# EAGLE design Schematic (EAGLE 7.4.0)
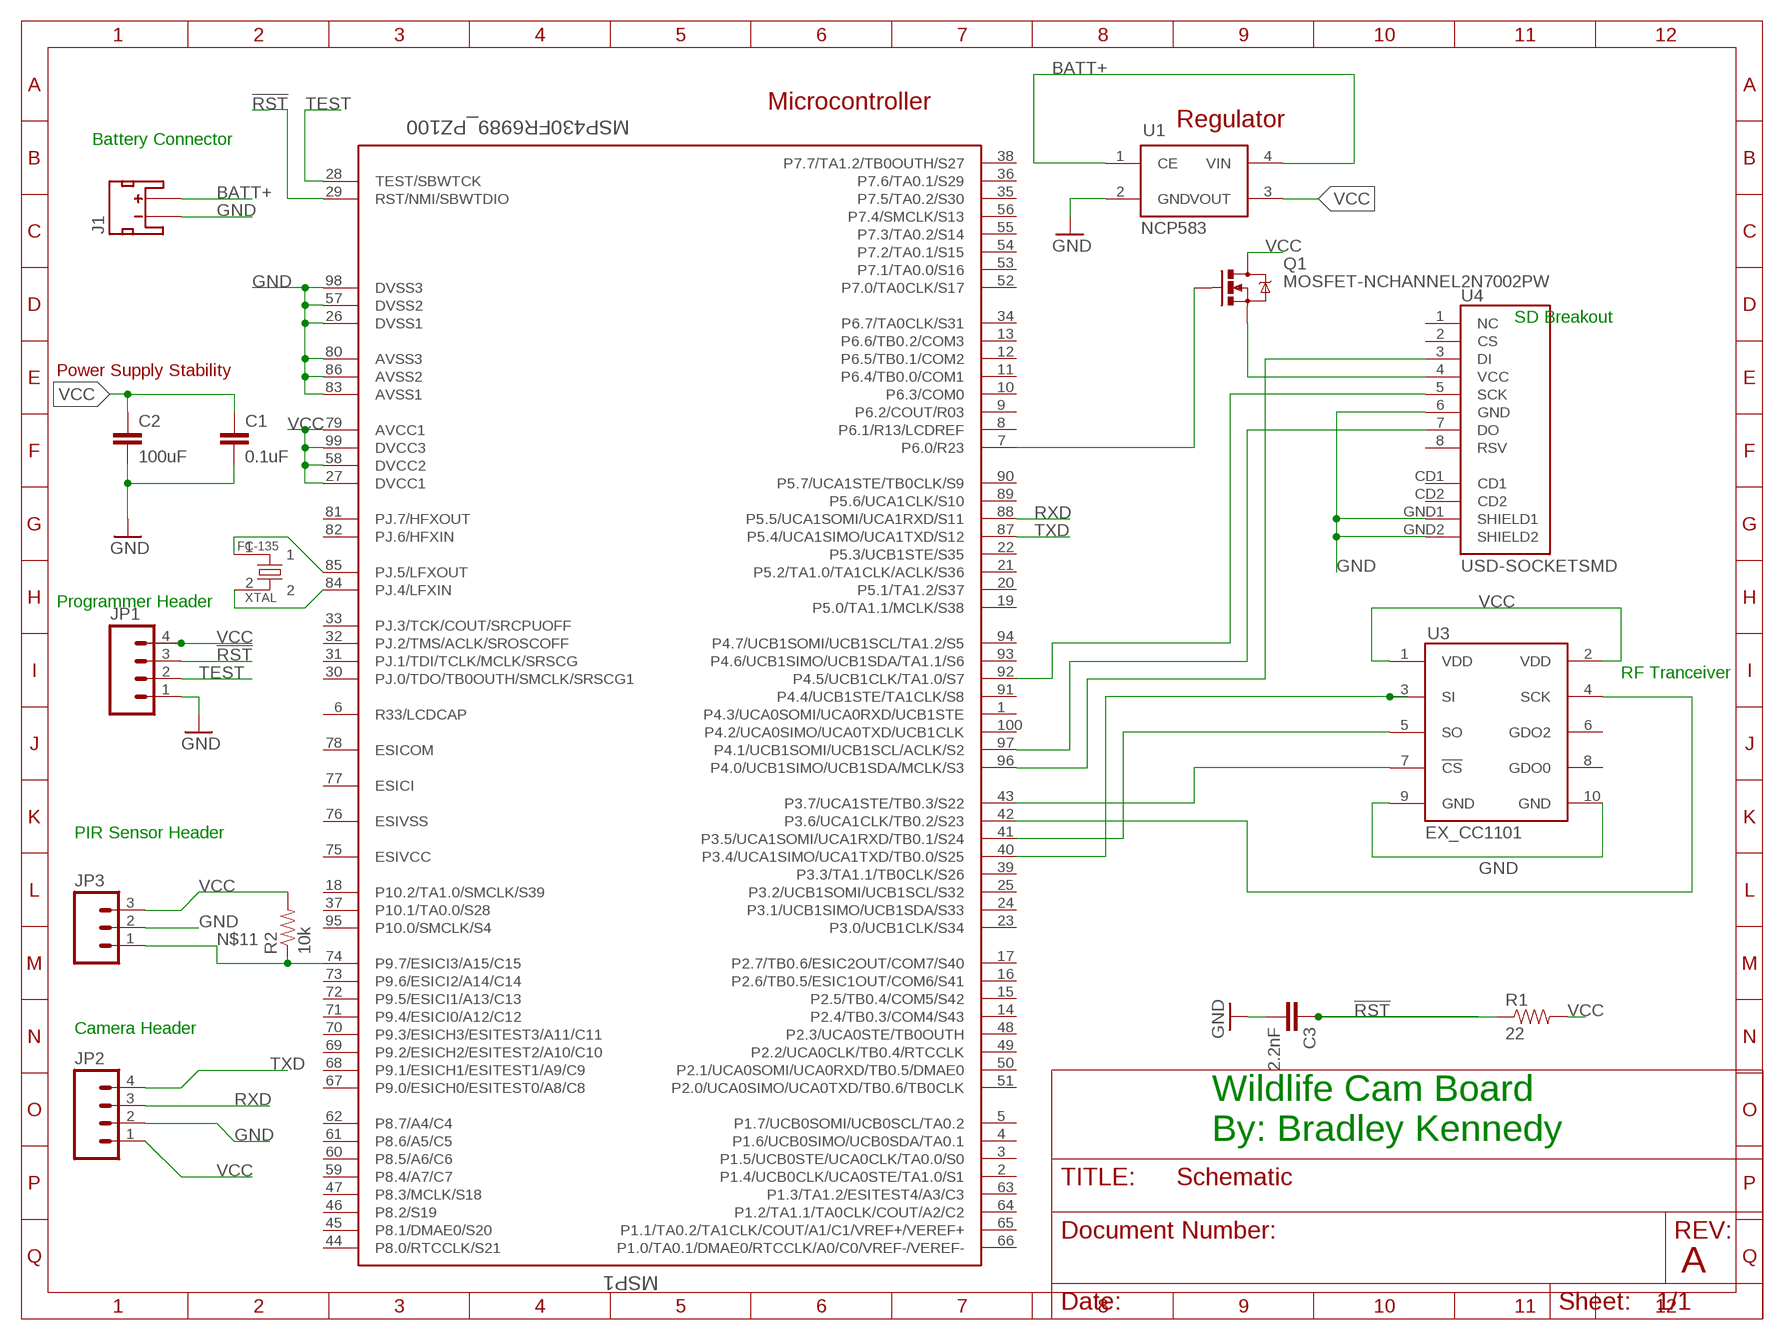
[diagram p0: schematic, sheet 1]

## Parts
C1  0.1uF  1.0UF-25V-+80/-20(0805)  [0805]
C2  100uF  1.0UF-25V-+80/-20(0805)  [0805]
C3  2.2nF  1.0UF-25V-+80/-20(0805)  [0805]
J1  JST_2MM_MALE  [JST-2-SMD]
JP1  M04PTH  [1X04]
JP2  M04PTH  [1X04]
JP3  M03PTH  [1X03]
MSP1  MSP430FR6989_PZ100  [PZ100]
Q1  MOSFET-NCHANNEL2N7002PW  [SOT323]
R1  22  22OHM1/10W1%(0603)  [0603-RES]
R2  10k  10KOHM-1/4W-1%(PTH)HORIZ-KIT  [AXIAL-0.3EZ]
U1  NCP583  [SC82-AB_1PRIMARY]
U3  EX_CC1101  [2X5]
U4  USD-SOCKETSMD  [MICRO-SD-SOCKET-PP]
XTAL  FC-135  [FC-135_1PRIMARY]

## Nets
!RST: C3.1 JP1.3 MSP1.29(RST/NMI/SBWTDIO) R1.1
BATT+: J1.2(+) U1.1(CE) U1.4(VIN)
CLK: MSP1.42(P3.6/UCA1CLK/TB0.2/S23) U3.4(SCK)
GND: C1.2 C2.2 C3.2 J1.1(-) JP1.1 JP2.2 JP3.2 MSP1.26(DVSS1) MSP1.57(DVSS2) MSP1.80(AVSS3) MSP1.83(AVSS1) MSP1.86(AVSS2) MSP1.98(DVSS3) U1.2(GND) U3.9(GND) U3.10(GND) U4.6(GND) U4.GND1(SHIELD1) U4.GND2(SHIELD2)
N$1: MSP1.40(P3.4/UCA1SIMO/UCA1TXD/TB0.0/S25) U3.3(SI)
N$2: MSP1.97(P4.1/UCB1SOMI/UCB1SCL/ACLK/S2) U4.7(DO)
N$3: MSP1.96(P4.0/UCB1SIMO/UCB1SDA/MCLK/S3) U4.3(DI)
N$4: MSP1.84(PJ.4/LFXIN) XTAL.2
N$5: MSP1.85(PJ.5/LFXOUT) XTAL.1
N$6: MSP1.43(P3.7/UCA1STE/TB0.3/S22) U3.7(!CS)
N$7: Q1.2(S) U4.4(VCC)
N$8: MSP1.7(P6.0/R23) Q1.1(G)
N$9: MSP1.92(P4.5/UCB1CLK/TA1.0/S7) U4.5(SCK)
N$11: JP3.1 MSP1.74(P9.7/ESICI3/A15/C15) R2.P$1
N$12: MSP1.41(P3.5/UCA1SOMI/UCA1RXD/TB0.1/S24) U3.5(SO)
RXD: JP2.3 MSP1.88(P5.5/UCA1SOMI/UCA1RXD/S11)
TEST: JP1.2 MSP1.28(TEST/SBWTCK)
TXD: JP2.4 MSP1.87(P5.4/UCA1SIMO/UCA1TXD/S12)
VCC: C1.1 C2.1 JP1.4 JP2.1 JP3.3 MSP1.27(DVCC1) MSP1.58(DVCC2) MSP1.79(AVCC1) MSP1.99(DVCC3) Q1.3(D) R1.2 R2.P$2 U1.3(VOUT) U3.1(VDD) U3.2(VDD)
Unconnected: J1.NC1(PAD1) J1.NC2(PAD2) MSP1.1(P4.3/UCA0SOMI/UCA0RXD/UCB1STE) MSP1.2(P1.4/UCB0CLK/UCA0STE/TA1.0/S1) MSP1.3(P1.5/UCB0STE/UCA0CLK/TA0.0/S0) MSP1.4(P1.6/UCB0SIMO/UCB0SDA/TA0.1) MSP1.5(P1.7/UCB0SOMI/UCB0SCL/TA0.2) MSP1.6(R33/LCDCAP) MSP1.8(P6.1/R13/LCDREF) MSP1.9(P6.2/COUT/R03) MSP1.10(P6.3/COM0) MSP1.11(P6.4/TB0.0/COM1) MSP1.12(P6.5/TB0.1/COM2) MSP1.13(P6.6/TB0.2/COM3) MSP1.14(P2.4/TB0.3/COM4/S43) MSP1.15(P2.5/TB0.4/COM5/S42) MSP1.16(P2.6/TB0.5/ESIC1OUT/COM6/S41) MSP1.17(P2.7/TB0.6/ESIC2OUT/COM7/S40) MSP1.18(P10.2/TA1.0/SMCLK/S39) MSP1.19(P5.0/TA1.1/MCLK/S38) MSP1.20(P5.1/TA1.2/S37) MSP1.21(P5.2/TA1.0/TA1CLK/ACLK/S36) MSP1.22(P5.3/UCB1STE/S35) MSP1.23(P3.0/UCB1CLK/S34) MSP1.24(P3.1/UCB1SIMO/UCB1SDA/S33) MSP1.25(P3.2/UCB1SOMI/UCB1SCL/S32) MSP1.30(PJ.0/TDO/TB0OUTH/SMCLK/SRSCG1) MSP1.31(PJ.1/TDI/TCLK/MCLK/SRSCG) MSP1.32(PJ.2/TMS/ACLK/SROSCOFF) MSP1.33(PJ.3/TCK/COUT/SRCPUOFF) MSP1.34(P6.7/TA0CLK/S31) MSP1.35(P7.5/TA0.2/S30) MSP1.36(P7.6/TA0.1/S29) MSP1.37(P10.1/TA0.0/S28) MSP1.38(P7.7/TA1.2/TB0OUTH/S27) MSP1.39(P3.3/TA1.1/TB0CLK/S26) MSP1.44(P8.0/RTCCLK/S21) MSP1.45(P8.1/DMAE0/S20) MSP1.46(P8.2/S19) MSP1.47(P8.3/MCLK/S18) MSP1.48(P2.3/UCA0STE/TB0OUTH) MSP1.49(P2.2/UCA0CLK/TB0.4/RTCCLK) MSP1.50(P2.1/UCA0SOMI/UCA0RXD/TB0.5/DMAE0) MSP1.51(P2.0/UCA0SIMO/UCA0TXD/TB0.6/TB0CLK) MSP1.52(P7.0/TA0CLK/S17) MSP1.53(P7.1/TA0.0/S16) MSP1.54(P7.2/TA0.1/S15) MSP1.55(P7.3/TA0.2/S14) MSP1.56(P7.4/SMCLK/S13) MSP1.59(P8.4/A7/C7) MSP1.60(P8.5/A6/C6) MSP1.61(P8.6/A5/C5) MSP1.62(P8.7/A4/C4) MSP1.63(P1.3/TA1.2/ESITEST4/A3/C3) MSP1.64(P1.2/TA1.1/TA0CLK/COUT/A2/C2) MSP1.65(P1.1/TA0.2/TA1CLK/COUT/A1/C1/VREF+/VEREF+) MSP1.66(P1.0/TA0.1/DMAE0/RTCCLK/A0/C0/VREF-/VEREF-) MSP1.67(P9.0/ESICH0/ESITEST0/A8/C8) MSP1.68(P9.1/ESICH1/ESITEST1/A9/C9) MSP1.69(P9.2/ESICH2/ESITEST2/A10/C10) MSP1.70(P9.3/ESICH3/ESITEST3/A11/C11) MSP1.71(P9.4/ESICI0/A12/C12) MSP1.72(P9.5/ESICI1/A13/C13) MSP1.73(P9.6/ESICI2/A14/C14) MSP1.75(ESIVCC) MSP1.76(ESIVSS) MSP1.77(ESICI) MSP1.78(ESICOM) MSP1.81(PJ.7/HFXOUT) MSP1.82(PJ.6/HFXIN) MSP1.89(P5.6/UCA1CLK/S10) MSP1.90(P5.7/UCA1STE/TB0CLK/S9) MSP1.91(P4.4/UCB1STE/TA1CLK/S8) MSP1.93(P4.6/UCB1SIMO/UCB1SDA/TA1.1/S6) MSP1.94(P4.7/UCB1SOMI/UCB1SCL/TA1.2/S5) MSP1.95(P10.0/SMCLK/S4) MSP1.100(P4.2/UCA0SIMO/UCA0TXD/UCB1CLK) U3.6(GDO2) U3.8(GDO0) U4.1(NC) U4.2(CS) U4.8(RSV) U4.CD1 U4.CD2

## Notes on the sheet
- Microcontroller
- Regulator
- Battery Connector
- SD Breakout
- Power Supply Stability
- Programmer Header
- RF Tranceiver
- PIR Sensor Header
- Camera Header
- Wildlife Cam Board
  By: Bradley Kennedy
- A

## Library data of the parts
C1-C3 = SparkFun-Capacitors:1.0UF-25V-+80/-20(0805); PROD_ID: CAP-11625; VALUE: 1.0uF
J1 = SparkFun-Connectors:JST_2MM_MALE: Mates to single-cell LiPo batteries. CONN-11443 Now with smashable polarity marks!; BTM_NEG: -; BTM_POS: +; PROD_ID: CONN-11443; TOP_NEG: -; TOP_POS: +
JP1 JP2 = SparkFun-Connectors:M04: Header 4 Standard 4-pin 0.1" header. Use with straight break away headers (SKU : PRT-00116), right angle break away headers (PRT-00553), swiss pins (PRT-00743), machine pins (PRT-00117), and female headers (PRT-00115). Molex polarized connector foot print use with SKU : PRT-08231 with associated crimp pins and housings. 1MM SMD Version SKU: PRT-10208
JP3 = SparkFun-Connectors:M03: Header 3 Standard 3-pin 0.1" header. Use with straight break away headers (SKU : PRT-00116), right angle break away headers (PRT-00553), swiss pins (PRT-00743), machine pins (PRT-00117), and female headers (PRT-00115). Molex polarized connector foot print use with SKU : PRT-08232 with associated crimp pins and housings.
MSP1 = msp430:MSP430FR6989_PZ100
Q1 = SparkFun-DiscreteSemi:MOSFET-NCHANNEL: Common NMOSFET Parts MFG P/N Store ID Prod ID FDD8780 TRANS-09984 SI7820DN TRANS-11055 FDS6630A IC-08089 2N7002PW TRANS-11151 FQP30N06L COM-10213 TRANS-10060 BSS123LT1G TRANS-08345 BSS138 TRANS-00830 BS170 2N7000; PROD_ID: TRANS-11151
R1 = SparkFun-Resistors:22OHM1/10W1%(0603): RES-08698; PROD_ID: RES-08698
R2 = SparkFun-Resistors:10KOHM-1/4W-1%(PTH): RES-12183; PROD_ID: RES-12183
U1 = ncp583:NCP583: NCP583 - Ultra-Low Iq 150 mA CMOS LDO Regulator with Enable The NCP583 series of low dropout regulators are designed for portable battery powered applications which require precise output voltage accuracy and low quiescent current. These devices feature an enable function which lowers current consumption significantly and are offered in two small packages; SC−82AB and the SOT−563. A 1.0 mF ceramic capacitor is the recommended value to be used with these devices on the output pin.
U3 = rf_connect:EX_CC1101: CC1101 Breakout Pins Use this to connect the common CC1101 radio boards
U4 = microSD-Breakout-v14:USD-SOCKET: microSD Socket Push-push type uSD socket. Schematic element and footprint production proven. Spark Fun Electronics SKU : PRT-00127. tDoc lines correctly indicate media card edge positions when inserting (unlocked, locked, depressed).
XTAL = fc-135:FC-135

## Board
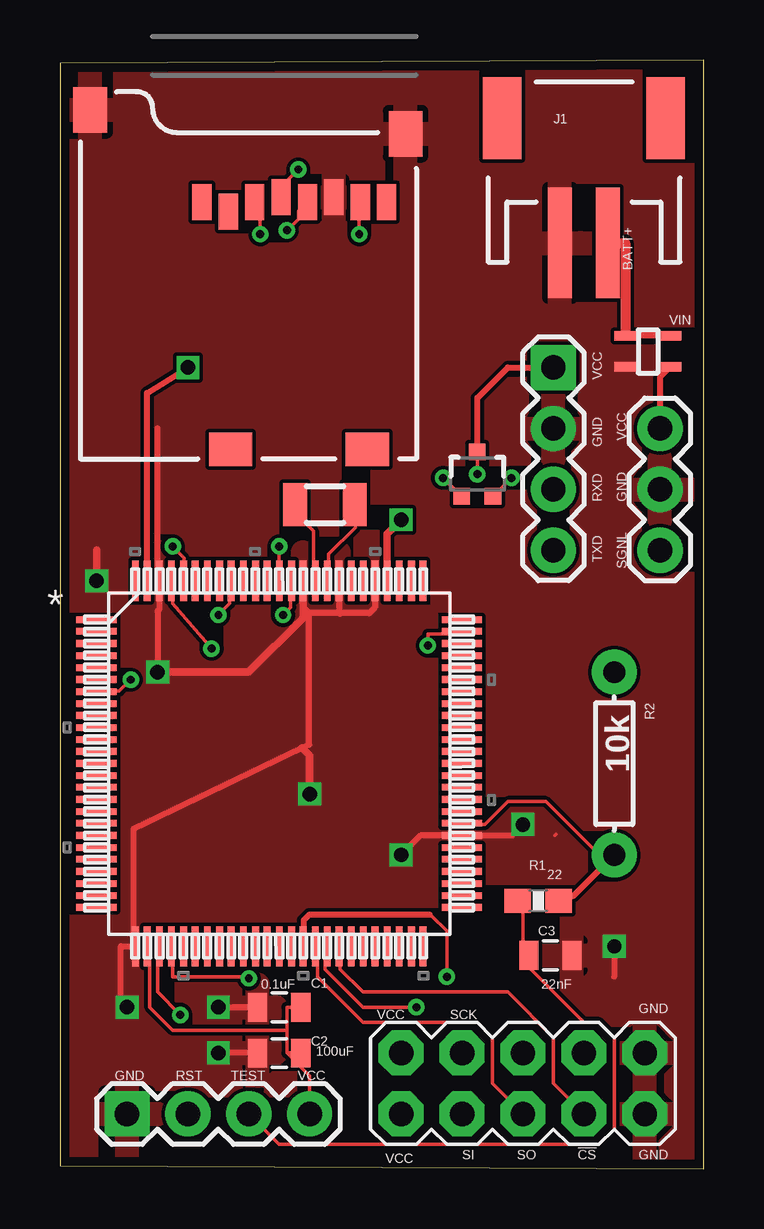
[diagram p1: board, top side]
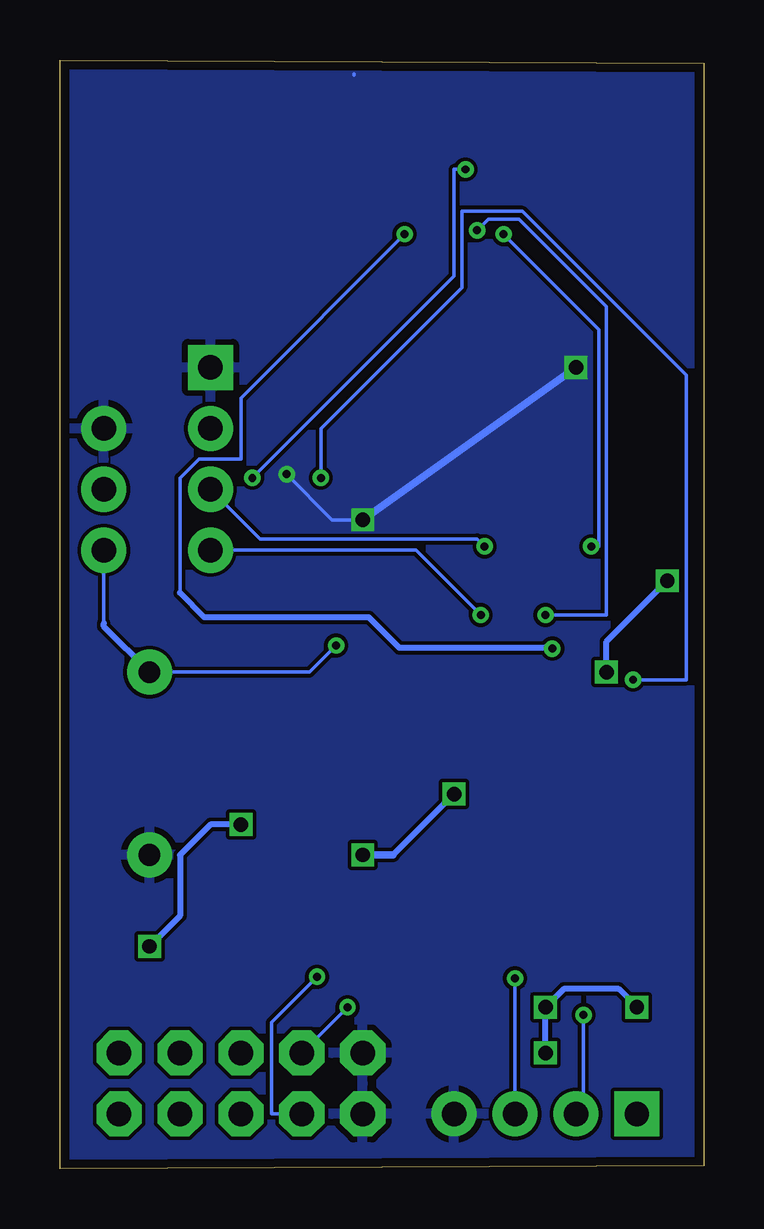
[diagram p2: board, bottom side, seen from below]

Size 26.85 x 46.22 mm. Coordinates in mm from the lower left corner, seen from the top.
Outline: 0,0.13 26.85,0 26.85,46.22 0,46.09 0,0.13
Copper layers (1*16): Top 0.0356mm / dielectric 1.5011mm / Bottom 0.0356mm
Design rules "LaenPCBOrder": minimum track width 6mil, minimum drill 13mil, track to track 6mil, track to pad 6mil, pad to pad 6mil, via to via 6mil, smd to smd 6mil, copper to edge 15mil, drill to drill 6mil, minimum pad ring 7mil, minimum via ring 7mil, stop-mask expansion 3mil, vias tented up to drill 0mil, thermal gap 10mil

### Footprints (pad centres in the part's own frame; a part is rotated, then mirrored left to right if it is on the bottom)
0805 = smd 0.8 x 1.2: 1 -0.9,0; 2 0.9,0
JST-2-SMD = smd 1 x 4.6: 1 -1,-3.7; 2 1,-3.7 | smd 1.6 x 3.4: NC1 -3.4,1.5; NC2 3.4,1.5
1X04 = drill 1.016 pad 1.88 square: 1 0,0 | drill 1.016 pad 1.88: 2 2.54,0; 3 5.08,0; 4 7.62,0
1X03 = drill 1.016 pad 1.88: 1 0,0; 2 2.54,0; 3 5.08,0
PZ100 = smd 1.676 x 0.279: 1 -7.62,5.994; 2 -7.62,5.512; 3 -7.62,5.004; 4 -7.62,4.496; 5 -7.62,3.988; 6 -7.62,3.505; 7 -7.62,2.997; 8 -7.62,2.489; 9 -7.62,2.007; 10 -7.62,1.499; 11 -7.62,0.991; 12 -7.62,0.508; 13 -7.62,0; 14 -7.62,-0.508; 15 -7.62,-0.991; 16 -7.62,-1.499; 17 -7.62,-2.007; 18 -7.62,-2.489; 19 -7.62,-2.997; 20 -7.62,-3.505; 21 -7.62,-3.988; 22 -7.62,-4.496; 23 -7.62,-5.004; 24 -7.62,-5.512; 25 -7.62,-5.994; 51 7.62,-5.994; 52 7.62,-5.512; 53 7.62,-5.004; 54 7.62,-4.496; 55 7.62,-3.988; 56 7.62,-3.505; 57 7.62,-2.997; 58 7.62,-2.489; 59 7.62,-2.007; 60 7.62,-1.499; 61 7.62,-0.991; 62 7.62,-0.508; 63 7.62,0; 64 7.62,0.508; 65 7.62,0.991; 66 7.62,1.499; 67 7.62,2.007; 68 7.62,2.489; 69 7.62,2.997; 70 7.62,3.505; 71 7.62,3.988; 72 7.62,4.496; 73 7.62,5.004; 74 7.62,5.512; 75 7.62,5.994 | smd 0.279 x 1.676: 26 -5.994,-7.62; 27 -5.512,-7.62; 28 -5.004,-7.62; 29 -4.496,-7.62; 30 -3.988,-7.62; 31 -3.505,-7.62; 32 -2.997,-7.62; 33 -2.489,-7.62; 34 -2.007,-7.62; 35 -1.499,-7.62; 36 -0.991,-7.62; 37 -0.508,-7.62; 38 0,-7.62; 39 0.508,-7.62; 40 0.991,-7.62; 41 1.499,-7.62; 42 2.007,-7.62; 43 2.489,-7.62; 44 2.997,-7.62; 45 3.505,-7.62; 46 3.988,-7.62; 47 4.496,-7.62; 48 5.004,-7.62; 49 5.512,-7.62; 50 5.994,-7.62; 76 5.994,7.62; 77 5.512,7.62; 78 5.004,7.62; 79 4.496,7.62; 80 3.988,7.62; 81 3.505,7.62; 82 2.997,7.62; 83 2.489,7.62; 84 2.007,7.62; 85 1.499,7.62; 86 0.991,7.62; 87 0.508,7.62; 88 0,7.62; 89 -0.508,7.62; 90 -0.991,7.62; 91 -1.499,7.62; 92 -2.007,7.62; 93 -2.489,7.62; 94 -2.997,7.62; 95 -3.505,7.62; 96 -3.988,7.62; 97 -4.496,7.62; 98 -5.004,7.62; 99 -5.512,7.62; 100 -5.994,7.62
SOT323 = smd 0.7 x 0.7: 1 -0.65,-0.925; 2 0.65,-0.925; 3 0,0.925
0603-RES = smd 1.1 x 1: 1 -0.85,0; 2 0.85,0
AXIAL-0.3EZ = drill 0.9 pad 1.88: P$1 -3.81,0; P$2 3.81,0
SC82-AB_1PRIMARY = smd 0.406 x 0.914: 1 -1.321,-0.813; 2 -0.025,-0.813; 3 -0.025,1.067; 4 -1.321,1.067
2X5 = drill 1.016 pad 1.88 octagon: 1 -5.08,-1.27; 2 -5.08,1.27; 3 -2.54,-1.27; 4 -2.54,1.27; 5 0,-1.27; 6 0,1.27; 7 2.54,-1.27; 8 2.54,1.27; 9 5.08,-1.27; 10 5.08,1.27
MICRO-SD-SOCKET-PP = smd 0.8 x 1.5: 1 -8.94,10.7; 2 -7.84,10.3; 3 -6.74,10.7; 4 -5.64,10.9; 5 -4.54,10.7; 6 -3.44,10.9; 7 -2.34,10.7; 8 -1.24,10.7 | smd 1.8 x 1.4: CD1 -7.75,0.4; CD2 -2.05,0.4 | smd 1.4 x 1.9: GND1 -13.6,14.55; GND2 -0.45,13.55
FC-135_1PRIMARY = smd 0.991 x 1.803: 1 -1.245,0; 2 1.245,0

### Placement (x,y rotation side)
C1  9.14,6.73 180 top
C2  9.14,4.83 180 top
C3  20.45,8.89 0 top
J1  21.84,42.29 0 top
JP1  2.79,2.29 0 top
JP2  20.57,33.4 270 top
JP3  25.02,25.78 90 top
MSP1  9.14,16.89 0 top
Q1  17.4,28.96 0 top
R1  19.94,11.18 0 top
R2  23.11,16.89 270 top
U1  24.38,33.4 270 top
U3  19.3,3.56 0 top
U4  14.86,29.59 0 top
XTAL  11.05,27.69 0 top

### Tracks (layer width: path | path; a pad name or v marks a point on that pad's centre or on a via)
!RST  (via drill 0.33)
  Top 0.152: 19.3,8.64 19.3,11.18 R1.1 | 19.3,8.64 21.84,6.1 22.48,6.1 23.11,5.46 23.11,1.65 22.48,1.02 9.14,1.02 JP1.3 | 19.3,8.64 C3.1 | MSP1.29 4.7,9.27 4.7,8 7.87,8 v7.87,7.94
  Bottom 0.152: JP1.3 v7.87,7.94
BATT+
  Top 0.254: U1.4 U1.1
  Top 0.406: J1.2 23.57,38.59 U1.1
CLK  (via drill 0.33)
  Top 0.152: v14.86,6.73 12.64,6.73 11.05,8.32 11.05,9.27 MSP1.42
  Bottom 0.152: U3.4 v14.86,6.73
GND  (via drill 0.6)
  Top 0.152: 20.68,13.94 20.63,13.9
  Top 0.254: 10.39,23.17 10.16,23.39 10.16,24.31 MSP1.86 | 10.39,23.17 11.68,23.17 12.9,23.17 13.13,23.39 MSP1.80 | 10.39,23.17 10.39,17.68 10.1,17.54 3.07,14.17 3.07,9.45 MSP1.26 2.54,9.27 2.54,6.99 v2.79,6.73 | MSP1.83 11.63,23.22 | 4.06,30.86 4.06,24.59 MSP1.98 4.14,23.32 4.06,23.24 v4.06,20.7 | v14.22,13.08 15.04,13.89 MSP1.57 18.85,13.89 v19.3,14.35 | v23.11,9.27 23.11,8 | 7.24,6.73 C1.2 v6.6,6.73 | C2.2 v6.6,4.83
  Top 0.305: 11.63,23.22 11.68,23.17 | v10.41,15.62 10.41,17.23 10.1,17.54 | MSP1.86 10.14,22.96 7.87,20.7 v4.06,20.7 | v1.52,24.51 1.52,25.78
  Bottom 0.254: 12.95,13.08 v10.41,15.62 | v4.06,20.7 4.06,21.97 v1.52,24.51 | v19.3,14.35 20.57,14.35 21.84,13.08 21.84,10.54 v23.11,9.27 | v6.6,4.83 v6.6,6.73 5.84,7.49 3.56,7.49 v2.79,6.73
  Bottom 0.305: v14.22,13.08 12.95,13.08
  pour Top: 0.25,45.85 0,0.38 26.92,0.38 26.92,46.1
N$1  (via drill 0.33)
  Top 0.152: v16.13,8 16.13,9.91 15.49,10.54 15.42,10.59
  Top 0.254: 15.42,10.59 10.39,10.59 10.16,10.36 10.16,9.45 MSP1.40
  Bottom 0.152: v16.13,8 18.03,6.1 18.03,2.29 U3.3
N$2  (via drill 0.33)
  Top 0.152: v12.48,38.96 12.48,40.23 U4.7 | v6.32,21.68 4.7,23.56 4.7,24.51 MSP1.97
  Bottom 0.152: v12.48,38.96 19.3,32.13 19.3,29.59 21.05,29.59 21.84,28.8 21.84,24
  Bottom 0.254: v6.32,21.68 6.35,21.72 12.7,21.72 13.97,22.99 20.83,22.99 21.84,24
N$3  (via drill 0.33)
  Top 0.152: v8.35,38.96 8.35,40.07 8.19,40.23 U4.3 | v4.7,25.94 5.18,25.46 5.18,24.51 MSP1.96
  Bottom 0.152: v8.35,38.96 4.38,34.99 4.38,25.94 v4.7,25.94
N$4
  Top 0.152: MSP1.84 11.21,24.51 11.21,25.62 12.32,26.73 12.32,27.69 XTAL.2
N$5
  Top 0.152: MSP1.85 10.57,24.51 10.57,26.57 9.94,27.21 9.94,27.69 XTAL.1
N$6
  Top 0.152: U3.7 20.57,3.56 20.57,5.46 18.67,7.37 12.64,7.37 11.68,8.32 11.68,9.27 MSP1.43
N$7  (via drill 0.33)
  Top 0.152: v18.83,28.8 18.19,28.16 Q1.2 | v9.94,41.66 9.3,41.02 9.3,40.55 U4.4
  Bottom 0.152: v18.83,28.8 10.41,37.21 10.41,41.66 v9.94,41.66
N$8  (via drill 0.33)
  Top 0.152: v15.97,28.8 16.61,28.16 Q1.1 | v2.95,20.38 2.48,19.91 1.52,19.91 MSP1.7
  Bottom 0.152: v15.97,28.8 15.97,30.86 10.1,36.73 10.1,39.91 7.56,39.91 0.73,33.08 0.73,20.38 v2.95,20.38
N$9  (via drill 0.33)
  Top 0.152: U4.5 9.94,39.91 9.94,39.59 v9.46,39.12 | v6.6,23.08 7.08,23.56 7.08,24.51 MSP1.92
  Bottom 0.152: v9.46,39.12 8.99,39.59 7.72,39.59 4.06,35.94 4.06,23.08 v6.6,23.08
N$11  (via drill 0.33)
  Top 0.152: v15.34,21.81 15.34,22.29 16.76,22.29 MSP1.74
  Bottom 0.152: v15.34,21.81 16.45,20.7 R2.P$1 | 25.02,22.73 JP3.1
  Bottom 0.254: R2.P$1 25.02,22.61 25.02,22.73
N$12
  Top 0.152: U3.5 18.03,3.56 18.03,5.46 17.4,6.1 12.64,6.1 10.73,8 10.73,9.27 MSP1.41
RXD  (via drill 0.33)
  Top 0.152: v9.14,25.94 MSP1.88
  Bottom 0.152: v9.14,25.94 9.46,26.26 18.51,26.26 JP2.3
TEST  (via drill 0.33)
  Top 0.152: v5.02,6.41 4.06,7.37 4.06,9.27 MSP1.28
  Bottom 0.152: v5.02,6.41 5.02,2.6 JP1.2
TXD  (via drill 0.33)
  Top 0.152: v9.3,23.08 9.62,23.4 9.62,24.51 MSP1.87
  Bottom 0.152: v9.3,23.08 12,25.78 JP2.4
VCC  (via drill 0.33, 0.6)
  Top 0.152: v17.4,28.96 Q1.3 | 22.8,12.76 20.26,15.3 18.67,15.3 17.72,14.35 16.76,14.35 MSP1.58 | 9.46,5.78 9.46,6.73 C1.1 | 9.46,5.78 9.46,4.83 | 9.46,5.78 4.7,5.78 3.75,6.73 3.75,9.27 MSP1.27 | JP1.4 10.41,3.87 9.46,4.83 | 9.46,4.83 C2.1
  Top 0.254: MSP1.99 3.63,32.33 v5.33,33.4 | R1.2 21.42,11.39 22.8,12.76 R2.P$2 | Q1.3 17.4,32.13 18.67,33.4 JP2.1 | U1.3 25.02,33 JP3.3
  Top 0.305: MSP1.79 13.64,26.47 v14.22,27.05
  Bottom 0.152: v17.4,28.96 15.49,27.05 v14.22,27.05 | 14.58,45.64 14.58,45.58
  Bottom 0.305: v5.33,33.4 v14.22,27.05
  pour Bottom: 0,46.35 0.25,0.38 27.18,0.38 26.92,45.85

### Text on the board
tPlace: BATT+ | VIN | VCC | GND | VCC | RXD | GND | TXD | SGNL | 22 | 0.1uF | 22nF | GND | VCC | SCK | 100uF | GND | RST | TEST | VCC | VCC | SI | SO | !CS | GND